# Altium schematic sheet MCU_external_components.SchDoc: MCU ext. components
size A4; Engineer: Danel Tiitma; Organization: MTÜ Tudengi Vormel; Address1: Pärnu mnt 62; Address2: Tallinn; Address3: Estonia, 10135; DocumentNumber: 4; Revision: 1; SheetNumber: 4; SheetTotal: 15
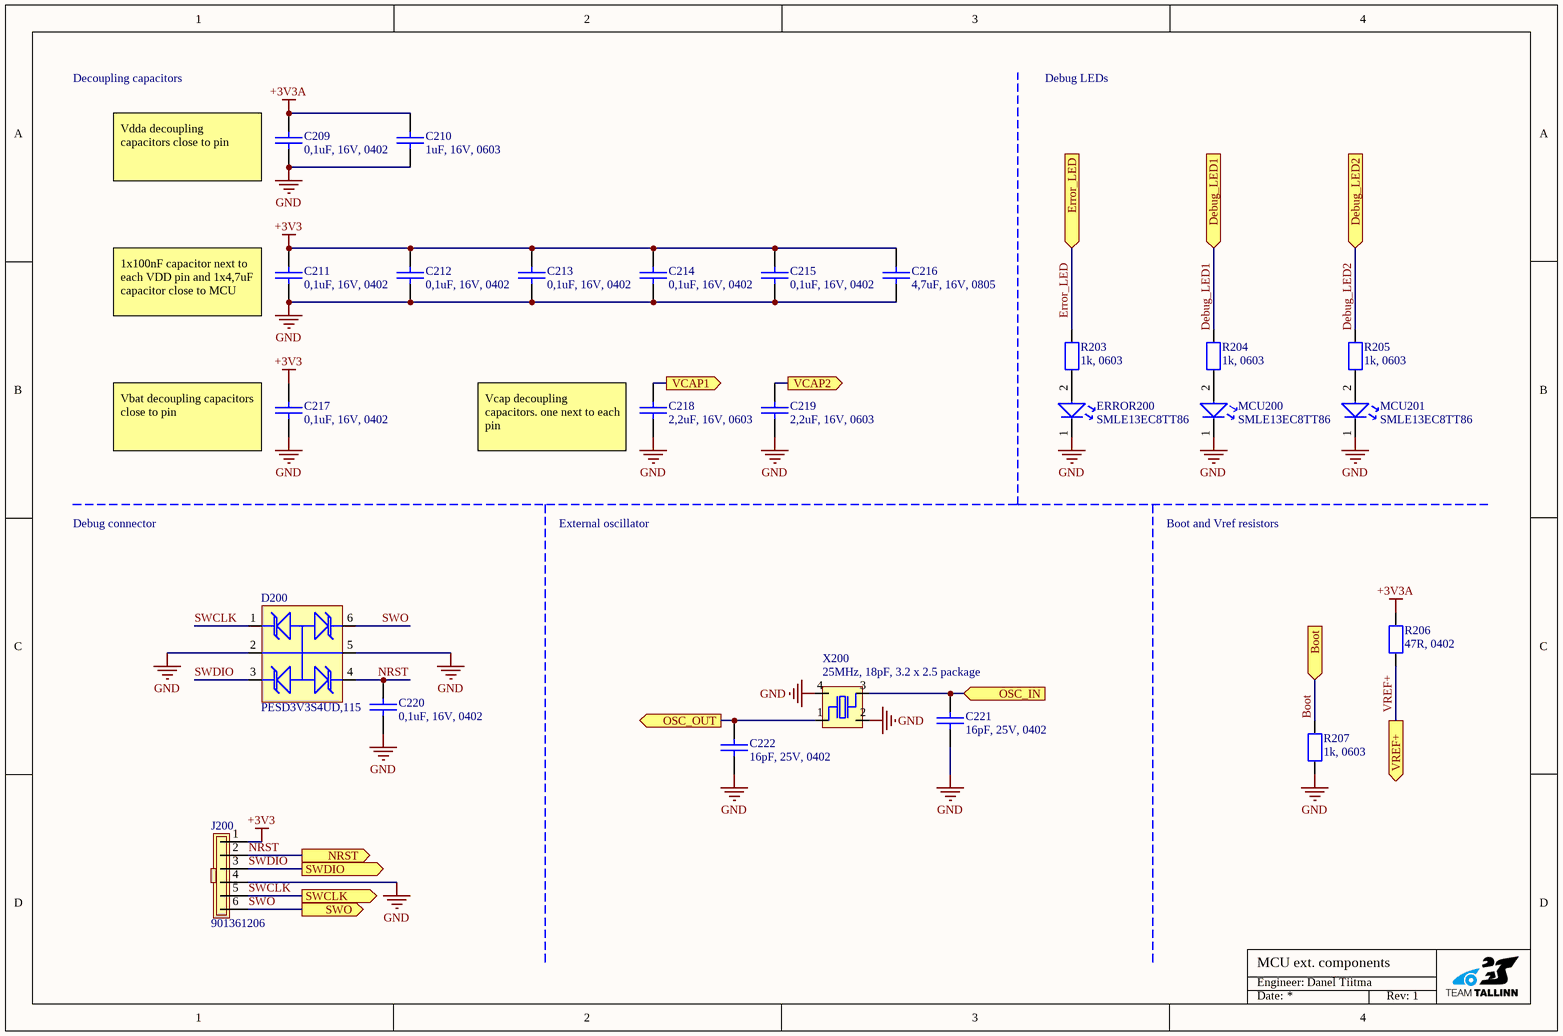
[diagram p0: MCU_external_components.SchDoc]

## Parts
C209  0,1uF, 16V, 0402  [CAP [0402] 1005]
C210  1uF, 16V, 0603  [CAP [0603] 1608]
C211  0,1uF, 16V, 0402  [CAP [0402] 1005]
C212  0,1uF, 16V, 0402  [CAP [0402] 1005]
C213  0,1uF, 16V, 0402  [CAP [0402] 1005]
C214  0,1uF, 16V, 0402  [CAP [0402] 1005]
C215  0,1uF, 16V, 0402  [CAP [0402] 1005]
C216  4,7uF, 16V, 0805  [CAP [0805] 2012]
C217  0,1uF, 16V, 0402  [CAP [0402] 1005]
C218  2,2uF, 16V, 0603  [CAP [0603] 1608]
C219  2,2uF, 16V, 0603  [CAP [0603] 1608]
C220  0,1uF, 16V, 0402  [CAP [0402] 1005]
C221  16pF, 25V, 0402  [CAP [0402] 1005]
C222  16pF, 25V, 0402  [CAP [0402] 1005]
D200  PESD3V3S4UD,115  [SOT23-6]
ERROR200  SMLE13EC8TT86  [LED [0603] 1608]
J200  901361206  [901361206]
MCU200  SMLE13EC8TT86  [LED [0603] 1608]
MCU201  SMLE13EC8TT86  [LED [0603] 1608]
R203  1k, 0603  [RES [0603] 1608]
R204  1k, 0603  [RES [0603] 1608]
R205  1k, 0603  [RES [0603] 1608]
R206  47R, 0402  [RES [0402] 1005]
R207  1k, 0603  [RES [0603] 1608]
X200  25MHz, 18pF, 3.2 x 2.5 package  [Crystal 3.2x2.5mm]

## Ports
Boot (in), Debug_LED1 (in), Debug_LED2 (in), Error_LED (in), NRST (out), OSC_IN (in), OSC_OUT (out), SWCLK (out), SWDIO (out), SWO (out), VCAP1 (out), VCAP2 (out), VREF+ (out)

## Nets
+3V3: C211.2 C212.2 C213.2 C214.2 C215.2 C216.2 C217.2 J200.1
+3V3A: C209.2 C210.2 R206.2
GND: C209.1 C210.1 C211.1 C212.1 C213.1 C214.1 C215.1 C216.1 C217.1 C218.2 C219.2 C220.2 C221.2 C222.2 D200.2(GND) D200.5(GND) ERROR200.1 J200.4 MCU200.1 MCU201.1 R207.1 X200.2 X200.4
Boot: R207.2 ; port Boot
Debug_LED1: R204.2 ; port Debug_LED1
Debug_LED2: R205.2 ; port Debug_LED2
Error_LED: R203.2 ; port Error_LED
NRST: C220.1 D200.4(K3) J200.2 ; port NRST
OSC_IN: C221.1 X200.3 ; port OSC_IN
OSC_OUT: C222.1 X200.1 ; port OSC_OUT
SWCLK: D200.1(K1) J200.5 ; port SWCLK
SWDIO: D200.3(K2) J200.3 ; port SWDIO
SWO: D200.6(K4) J200.6 ; port SWO
VCAP1: C218.1 ; port VCAP1
VCAP2: C219.1 ; port VCAP2
VREF+: R206.1 ; port VREF+
NetERROR200_2: ERROR200.2 R203.1
NetMCU200_2: MCU200.2 R204.1
NetMCU201_2: MCU201.2 R205.1

## Notes on the sheet
- Decoupling capacitors
- Debug LEDs
- (near C209) Vdda decoupling capacitors close to pin
- (near C211) 1x100nF capacitor next to each VDD pin and 1x4,7uF capacitor close to MCU
- (near C217) Vbat decoupling capacitors close to pin
- (near C218) Vcap decoupling capacitors. one next to each pin
- Debug connector
- External oscillator
- Boot and Vref resistors
- Engineer:
- Date:
- Rev:

## Library data of the parts
C209-C217 C220 = CMP-001-00084-16: Default capacitor part; Supplier Part Number: *; Supplier: *; Manufacturer Part Number: *
C218 C219 = CMP-001-00014-2: Ceramic Capacitor, Multilayer, Ceramic, 16V, 20% +Tol, 20% -Tol, X5R, 15% TC, 2.2uF, Surface Mount, 0603; Manufacturer: TDK; Manufacturer Part Number: CGA3E1X5R1C225M080AC; Supplier Part Number: 810-CGA3E1X5R1C225MC; Price: 0,205; Supplier: Mouser; Datasheet: https://product.tdk.com/system/files/dam/doc/product/capacitor/ceramic/mlcc/catalog/mlcc_automotive_general_en.pdf
C221 C222 = CMP-001-00015-1: Ceramic Capacitor, Multilayer, Ceramic, 25V, 10% +Tol, 10% -Tol, X8R, 15% TC, 0.000016uF, Surface Mount, 0402; Manufacturer Part Number: C0402C160K3HACAUTO; Manufacturer: KEMET; Supplier: Digikey; Supplier Part Number: 399-C0402C160K3HACAUTOCT-ND; Price: 0.09
D200 = CMP-004-00032-2: Trans Voltage Suppressor Diode, 200W, 3.3V V(RWM), Unidirectional, 4 Element, Silicon; Manufacturer: Nexperia; Price: 0,428; Supplier Part Number: 771-PESD3V3S4UDT/R; Supplier: Mouser; Manufacturer Part Number: PESD3V3S4UD,115
ERROR200 MCU200 MCU201 = CMP-004-00006-2: Single Color LED, Green, Colorless Transparent, 1.2mm; Manufacturer Part Number: SMLE13EC8TT86; Supplier Part Number: 755-SMLE13EC8TT86; Supplier: Mouser
J200 = CMP-002-00026-4: Board Connector, 6 Contact(s), 1 Row(s), Male, Straight, 0.1 inch Pitch, Solder Terminal, Locking, Black Insulator, Receptacle; Manufacturer Part Number: 90136-1206; Manufacturer: Molex; Supplier Part Number: 538-90136-1206; Price: 1.53; Supplier: Mouser
R203-R207 = CMP-009-00038-12: Standard resistor part; Supplier Part Number: *; Manufacturer Part Number: *; Supplier: *
X200 = CMP-003-00030-3: Crystal 25MHz ±20ppm (Tol) ±30ppm (Stability) 18pF FUND 60Ohm 4-Pin Ultra Mini-CSMD T/R; Manufacturer Part Number: ABM8G-25.000MHZ-18-D2Y-T; Manufacturer: ABRACON; Supplier Part Number: 2101339; Supplier: Farnell